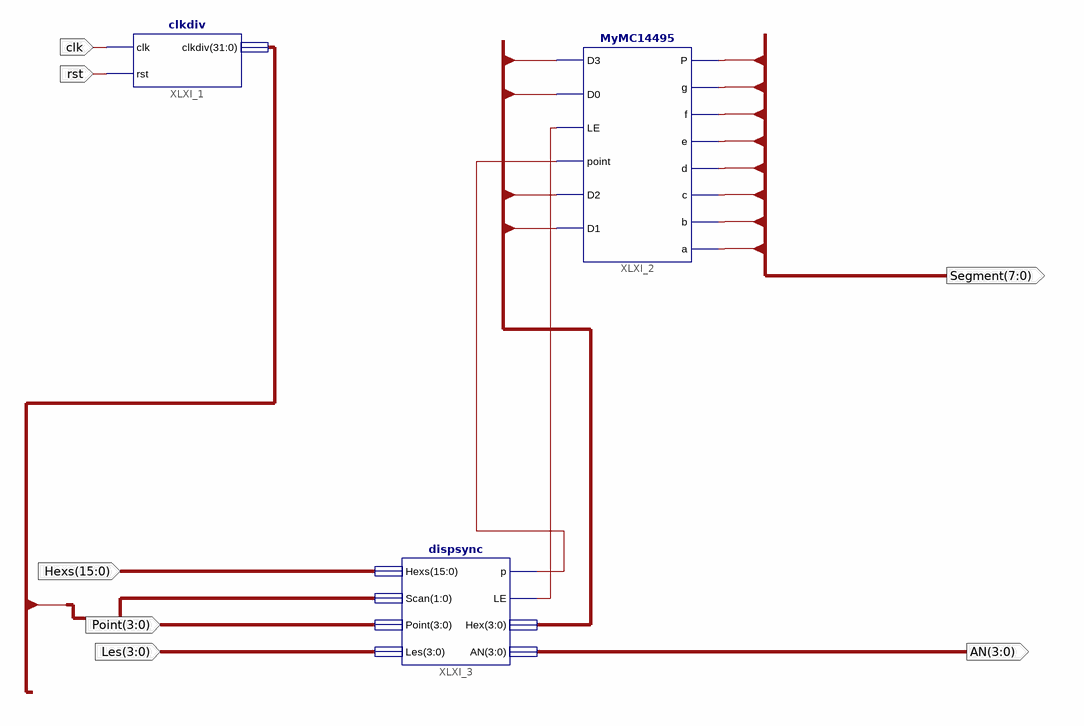
[diagram p0: schematic sheet 1]
// Xilinx ISE schematic disp_num.sch (kintex7) as structural Verilog: 3 symbols, 7 ports
module disp_num (
  input  clk,
  input  rst,
  input  [15:0] Hexs,
  input  [3:0] Point,
  input  [3:0] Les,
  output [7:0] Segment,
  output [3:0] AN
);

  wire XLXN_9, XLXN_14;
  wire [3:0] Hex;
  wire [31:0] clkdiv;

  clkdiv XLXI_1 (.clk(clk), .rst(rst), .clkdiv(clkdiv));
  MyMC14495 XLXI_2 (
    .D3(Hex[3]), .D0(Hex[0]), .LE(XLXN_9), .point(XLXN_14), .D2(Hex[2]), .D1(Hex[1]), .P(Segment[7]),
    .g(Segment[6]), .f(Segment[5]), .e(Segment[4]), .d(Segment[3]), .c(Segment[2]), .b(Segment[1]),
    .a(Segment[0]));
  dispsync XLXI_3 (
    .Hexs(Hexs), .Scan(clkdiv[18:17]), .Point(Point), .Les(Les), .p(XLXN_14), .LE(XLXN_9), .Hex(Hex), .AN(AN));
endmodule
